# EAGLE design FanRegulator (EAGLE 6.5.0)
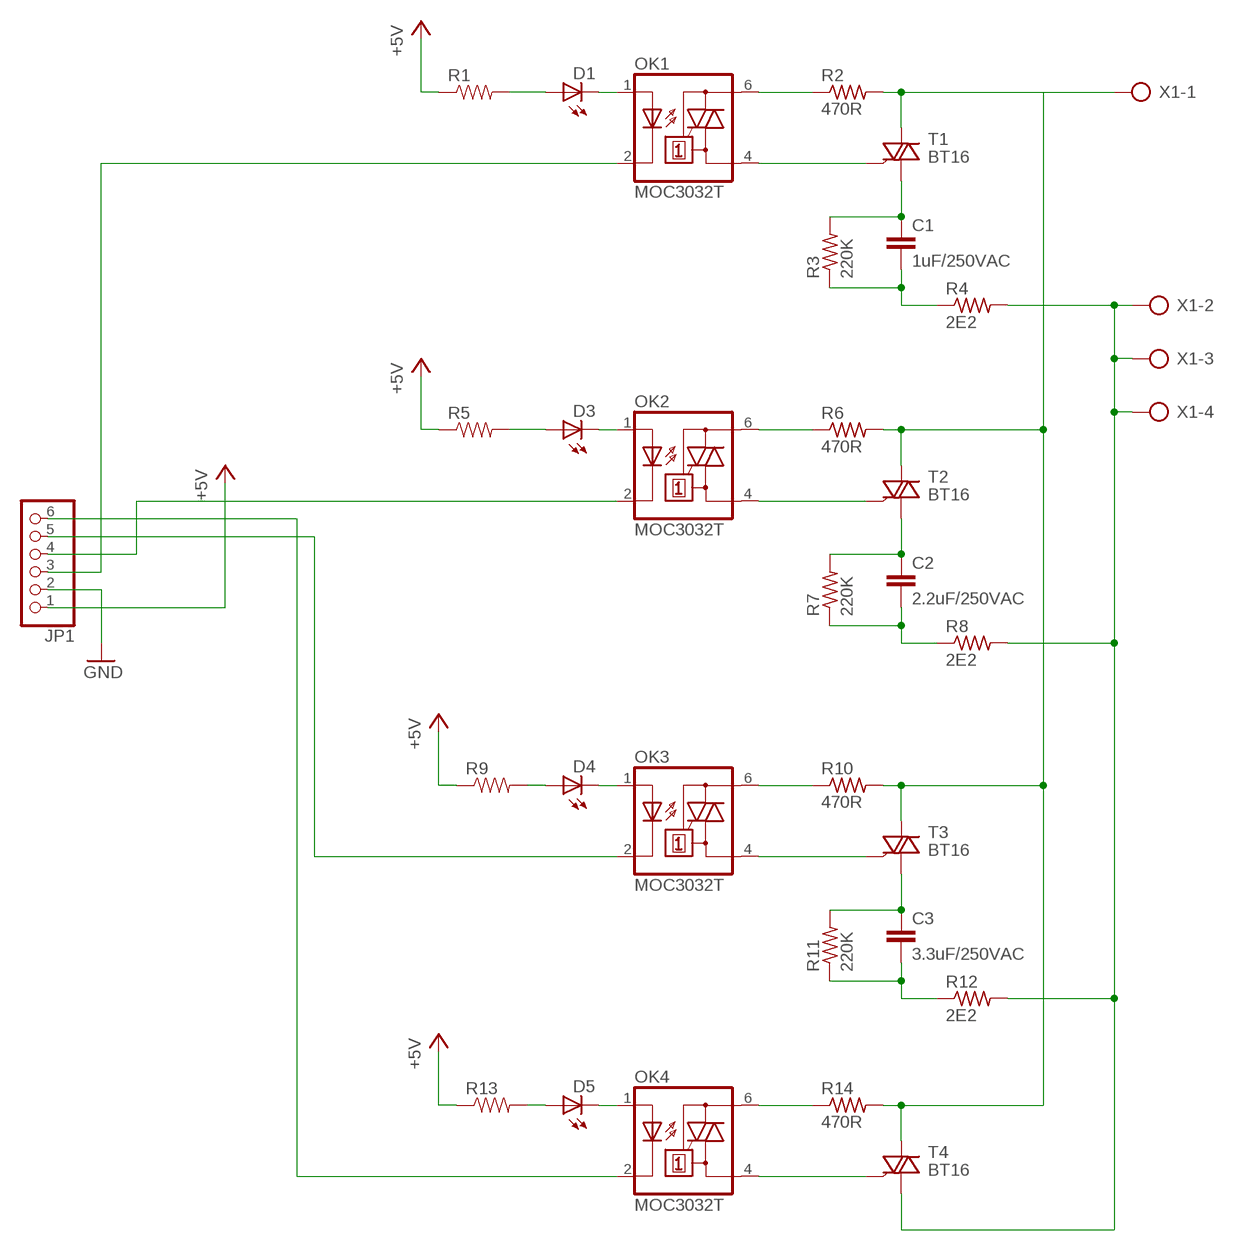
[diagram p0: schematic, sheet 1]

## Parts
C1  1uF/250VAC  C27/9  [C27.5B9]
C2  2.2uF/250VAC  C27/9  [C27.5B9]
C3  3.3uF/250VAC  C27/9  [C27.5B9]
D1  LED3MM  [LED3MM]
D3  LED3MM  [LED3MM]
D4  LED3MM  [LED3MM]
D5  LED3MM  [LED3MM]
JP1  PINHD-1X6  [1X06]
OK1  MOC3032T  [DIL06B]
OK2  MOC3032T  [DIL06B]
OK3  MOC3032T  [DIL06B]
OK4  MOC3032T  [DIL06B]
R1  RESISTOR1206  [1206]
R2  470R  6MM.1  [R0207/1V]
R3  220K  6MM.1  [R0207/1V]
R4  2E2  6MM.1  [R0207/1V]
R5  RESISTOR1206  [1206]
R6  470R  6MM.1  [R0207/1V]
R7  220K  6MM.1  [R0207/1V]
R8  2E2  6MM.1  [R0207/1V]
R9  RESISTOR1206  [1206]
R10  470R  6MM.1  [R0207/1V]
R11  220K  6MM.1  [R0207/1V]
R12  2E2  6MM.1  [R0207/1V]
R13  RESISTOR1206  [1206]
R14  470R  6MM.1  [R0207/1V]
T1  BT16  BT138-V  [TO220BV]
T2  BT16  BT138-V  [TO220BV]
T3  BT16  BT138-V  [TO220BV]
T4  BT16  BT138-V  [TO220BV]
X1  AK300/4  [AK300/4]

## Nets
+5V: JP1.1 R1.1 R5.1 R9.1 R13.1
GND: JP1.2
N$1: OK1.6(A2) R2.1
N$2: OK1.4(A1) T1.G
N$3: D1.A R1.2
N$4: C1.1 R3.2 T1.T1(A1)
N$5: C1.2 R3.1 R4.1
N$6: D1.K(C) OK1.1(A)
N$7: D3.A R5.2
N$8: JP1.3 OK1.2(C)
N$9: OK2.6(A2) R6.1
N$10: OK2.4(A1) T2.G
N$11: R2.2 R6.2 R10.2 R14.2 T1.T2(A2) T2.T2(A2) T3.T2(A2) T4.T2(A2) X1.1
N$12: C2.1 R7.2 T2.T1(A1)
N$13: C2.2 R7.1 R8.1
N$14: D3.K(C) OK2.1(A)
N$15: D4.A R9.2
N$16: JP1.4 OK2.2(C)
N$17: OK3.6(A2) R10.1
N$18: OK3.4(A1) T3.G
N$19: D4.K(C) OK3.1(A)
N$20: C3.1 R11.2 T3.T1(A1)
N$21: C3.2 R11.1 R12.1
N$22: D5.A R13.2
N$23: D5.K(C) OK4.1(A)
N$24: JP1.5 OK3.2(C)
N$25: OK4.6(A2) R14.1
N$26: OK4.4(A1) T4.G
N$32: JP1.6 OK4.2(C)
N$33: R4.2 R8.2 R12.2 T4.T1(A1) X1.2 X1.3 X1.4

## Library data of the parts
C1-C3 = capacitor-wima:C: CAPACITOR naming: grid - package width
D1 D3-D5 = led:LED: LED OSRAM: - CHIPLED LG R971, LG N971, LY N971, LG Q971, LY Q971, LO R971, LY R971 LH N974, LH R974 LS Q976, LO Q976, LY Q976 LO Q996 - Hyper CHIPLED LW Q18S LB Q993, LB Q99A, LB R99A - SideLED LS A670, LO A670, LY A670, LG A670, LP A670 LB A673, LV A673, LT A673, LW A673 LH A674 LY A675 LS A676, LA A676, LO A676, LY A676, LW A676 LS A679, LY A679, LG A679 - Hyper Micro SIDELED® LS Y876, LA Y876, LO Y876, LY Y876 LT Y87S - SmartLED LW L88C, LW L88S LB L89C, LB L89S, LG L890 LS L89K, LO L89K, LY L89K LS L896, LA L896, LO L896, LY L896 - TOPLED LS T670, LO T670, LY T670, LG T670, LP T670 LSG T670, LSP T670, LSY T670, LOP T670, LYG T670 LG T671, LOG T671, LSG T671 LB T673, LV T673, LT T673, LW T673 LH T674 LS T676, LA T676, LO T676, LY T676, LB T676, LH T676, LSB T676, LW T676 LB T67C, LV T67C, LT T67C, LS T67K, LO T67K, LY T67K, LW E67C LS E67B, LA E67B, LO E67B, LY E67B, LB E67C, LV E67C, LT E67C LW T67C LS T679, LY T679, LG T679 LS T770, LO T770, LY T770, LG T770, LP T770 LB T773, LV T773, LT T773, LW T773 LH T774 LS E675, LA E675, LY E675, LS T675 LS T776, LA T776, LO T776, LY T776, LB T776 LHGB T686 LT T68C, LB T68C - Hyper Mini TOPLED® LB M676 - Mini TOPLED Santana® LG M470 LS M47K, LO M47K, LY M47K Source: http://www.osram.convergy.de LUXEON: - LUMILED® LXK2-PW12-R00, LXK2-PW12-S00, LXK2-PW14-U00, LXK2-PW14-V00 LXK2-PM12-R00, LXK2-PM12-S00, LXK2-PM14-U00 LXK2-PE12-Q00, LXK2-PE12-R00, LXK2-PE12-S00, LXK2-PE14-T00, LXK2-PE14-U00 LXK2-PB12-K00, LXK2-PB12-L00, LXK2-PB12-M00, LXK2-PB14-N00, LXK2-PB14-P00, LXK2-PB14-Q00 LXK2-PR12-L00, LXK2-PR12-M00, LXK2-PR14-Q00, LXK2-PR14-R00 LXK2-PD12-Q00, LXK2-PD12-R00, LXK2-PD12-S00 LXK2-PH12-R00, LXK2-PH12-S00 LXK2-PL12-P00, LXK2-PL12-Q00, LXK2-PL12-R00 Source: www.luxeon.com KINGBRIGHT: KA-3528ASYC Source: www.kingbright.com
JP1 = pinhead:PINHD-1X6: PIN HEADER
OK1-OK4 = optocoupler:MOC30*: 6-Pin DIP Zero-Cross Optoisolators Triac Driver Output (250/400 Volt Peak) Source: Data sheet <http://www.fairchildsemi.com/ds/MO/MOC3031M.pdf> The old path of data sheet not more available 2013-05-06.; OC_FARNELL: unknown; OC_NEWARK: unknown
R1 R5 R9 R13 = SparkFun-Passives:RESISTOR: Resistor Basic schematic elements and footprints for 0603, 1206, and PTH resistors.
R2-R4 R6-R8 R10-R12 R14 = gm-resistors:6MM: 6mm Resistors Leads spaced 1-6 holes apart for 0.1" perfboard. Suitable for 1/4 watt resistors.
T1-T4 = triac:BT138: TRIAC Source: http://www.semiconductors.philips.com BT138_SERIES_2.pdf
X1 = con-ptr500:AK300/4: CONNECTOR; OC_FARNELL: unknown; OC_NEWARK: unknown

## Board
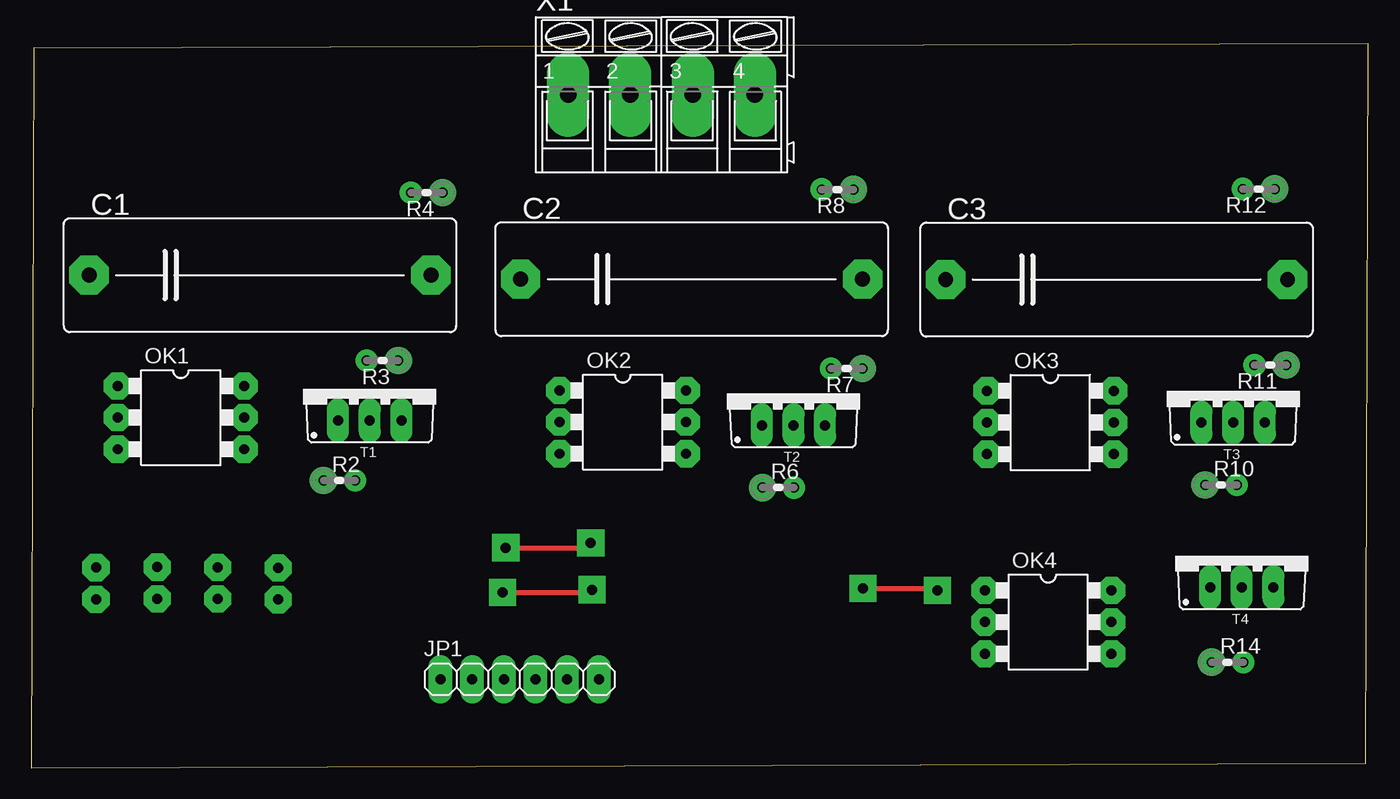
[diagram p1: board, top side]
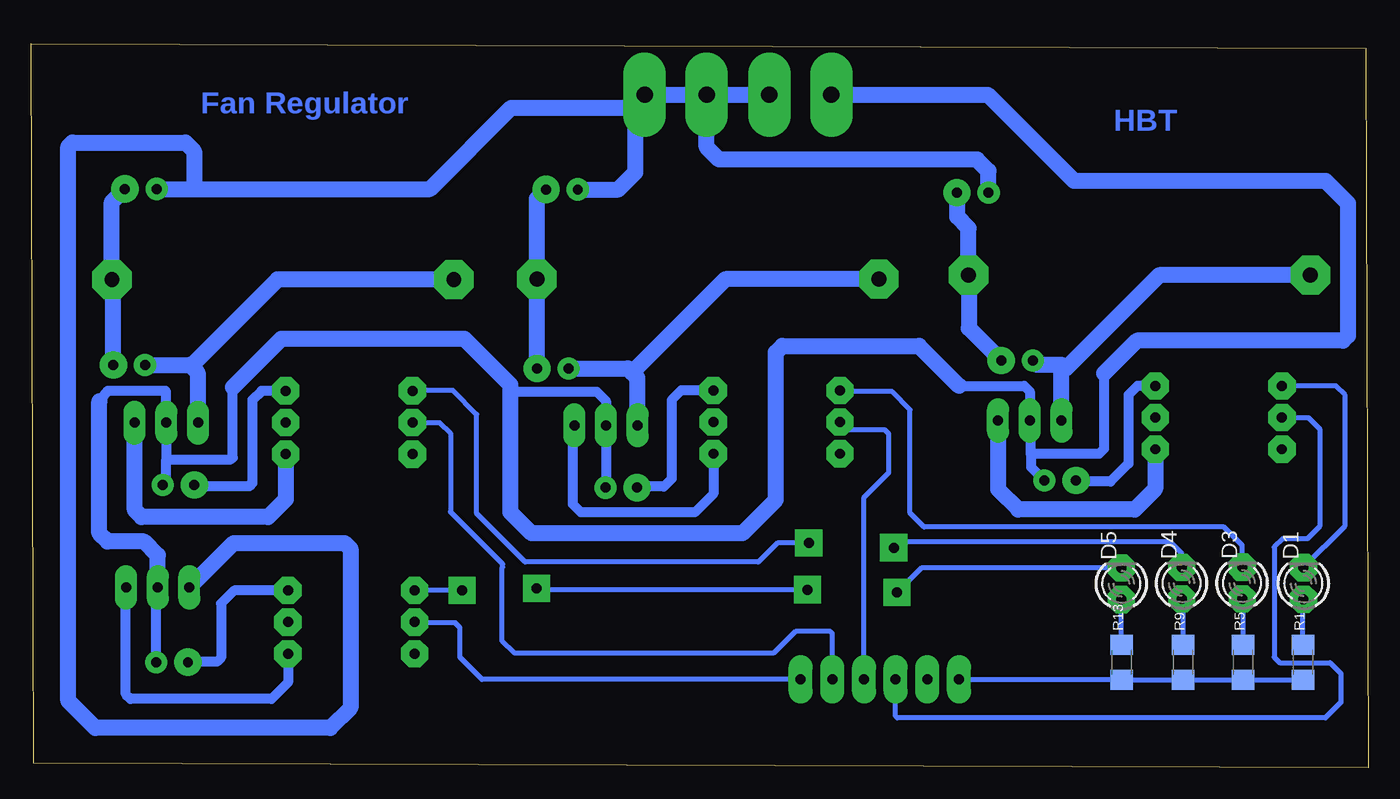
[diagram p2: board, bottom side, seen from below]

Size 107.28 x 58.11 mm. Coordinates in mm from the lower left corner, seen from the top.
Outline: 0,0 107.08,0.36 107.28,58.11 0.2,57.75 0,0
Copper layers (1*16): Top 0.035mm / dielectric 1.5mm / Bottom 0.035mm
Design rules "default": minimum track width 10mil, minimum drill 24mil, track to track 8mil, track to pad 8mil, pad to pad 8mil, via to via 8mil, smd to smd 8mil, copper to edge 40mil, drill to drill 8mil, minimum pad ring 10mil, minimum via ring 8mil, stop-mask expansion 4mil, vias tented up to drill 0mil, thermal gap 10mil

### Footprints (pad centres in the part's own frame; a part is rotated, then mirrored left to right if it is on the bottom)
C27.5B9 = drill 1.194 pad 3.15 octagon: 1 -13.716,0; 2 13.716,0
LED3MM = drill 0.8 pad 2.184 octagon: A -1.27,0; K 1.27,0
1X06 = drill 0.8 pad 1.93 long: 1 -6.35,0; 2 -3.81,0; 3 -1.27,0; 4 1.27,0; 5 3.81,0; 6 6.35,0
DIL06B = drill 0.8 pad 2.184 octagon: 1 -2.54,-5.08; 2 0,-5.08; 3 2.54,-5.08; 4 2.54,5.08; 5 0,5.08; 6 -2.54,5.08
1206 = smd 1.6 x 1.8: 1 -1.4,0; 2 1.4,0
R0207/1V = drill 0.8 pad 2.184: 1 -1.27,0 | drill 0.8 pad 1.778: 2 1.27,0
TO220BV = drill 0.8 pad 1.778 long: G 2.54,-2.54; T1 -2.54,-2.54; T2 0,-2.54
AK300/4 = drill 1.321 pad 3.4 long: 1 -7.493,0; 2 -2.515,0; 3 2.515,0; 4 7.493,0

### Placement (x,y rotation side)
C1  18.36,39.54 0 top
C2  52.99,39.21 0 top
C3  87.09,39.18 0 top
D1  5.2,14.8 90 bottom
D3  10.12,14.84 90 bottom
D4  14.97,14.82 90 bottom
D5  19.81,14.77 90 bottom
JP1  39.2,7.1 0 top
OK1  12.01,28.11 270 top
OK2  47.47,27.74 270 top
OK3  81.78,27.71 270 top
OK4  81.6,11.69 270 top
R1  5.24,8.47 90 bottom
R2  24.72,23.05 0 top
R3  28.19,32.68 180 top
R4  31.74,46.16 180 top
R5  10.04,8.48 90 bottom
R6  59.94,22.48 0 top
R7  65.43,32.04 180 top
R8  64.7,46.41 180 top
R9  14.86,8.47 90 bottom
R10  95.46,22.7 0 top
R11  99.42,32.33 180 top
R12  98.49,46.45 180 top
R13  19.8,8.47 90 bottom
R14  95.98,8.48 0 top
T1  27.17,30.41 0 top
T2  61.16,30.03 0 top
T3  96.44,30.23 0 top
T4  97.13,17.02 0 top
X1  50.57,54.02 0 top

### Tracks (layer width: path | path; a pad name or v marks a point on that pad's centre or on a via)
+5V
  Bottom 0.406: JP1.1 19.83,7.1 R13.1 R9.1 10.05,7.07 R5.1 R1.1
  Bottom 0.813: 19.8,7.1 R13.1
N$1
  Bottom 0.813: 23.3,23.19 R2.1 23.37,22.98 20.68,22.98 19.24,24.42 19.24,29.92 18.52,30.65 OK1.6
N$2
  Bottom 1.27: OK1.4 17.09,22.38 18.75,20.73 28.08,20.73 29.71,22.36 T1.G
N$3
  Bottom 0.406: R1.2 5.24,13.49 D1.A
N$4
  Bottom 0.813: 24.64,32.35 24.3,32.01 24.63,31.69 | R3.2 26.59,32.35
  Bottom 1.27: C1.1 16.78,39.54 24.3,32.01 | 26.59,32.35 24.64,32.35 | T1.T1 24.63,31.69
N$5
  Bottom 0.813: 32.06,39.52 C1.2 | 32.99,46.14 R4.1
  Bottom 1.27: C1.2 32.08,43.31 32.99,44.22 32.99,46.14 | 32.06,39.52 32.06,35.28 R3.1
N$6
  Bottom 0.406: D1.K 1.85,19.42 1.85,29.9 2.6,30.65 OK1.1
  Bottom 0.813: 6.93,30.66 OK1.1
N$7
  Bottom 0.406: R5.2 10.04,13.49 D3.A
N$8
  Bottom 0.406: OK1.2 4.8,28.11 3.9,27.2 3.9,19.38 4.9,18.39 6.88,18.39 7.56,17.71 7.56,8.88 7.12,8.44 3.07,8.44 2.19,7.57 2.19,5.25 3.44,4.01 37.78,4.01 37.93,4.15 JP1.3
N$9
  Bottom 0.813: R6.1 58.59,22.56 56.53,22.56 55.9,23.19 55.9,29.51 55.13,30.28 OK2.6
N$10
  Bottom 0.813: OK2.4 52.55,21.99 54.03,20.51 63.18,20.51 63.82,21.15 63.82,27.37 T2.G
N$11
  Bottom 0.813: R6.2 61.16,22.53 T2.T2 61.16,29.44 61.9,30.18 68.28,30.18 68.85,29.61 | 96.44,24.75 T3.T2 96.51,27.76 96.5,30.27 101.11,30.27 101.81,29.4 | R10.2 96.44,22.98 96.44,24.75 | R14.2 97.25,14.36 T4.T2 | 96.44,24.75 91.25,24.75 91.11,24.89 91.11,30.53 | 21.2,31.64 21.2,25.59 21.61,25.19 27.05,25.19 | 27.05,25.19 27.09,25.22 27.09,27.79 T1.T2 27.17,30.22 27.6,30.65 32.84,30.65 | R2.2 27.05,24.12 27.05,25.19
  Bottom 1.27: T4.T2 97.13,17.06 98.23,18.16 101.15,18.16 101.81,18.83 101.81,29.4 | 91.11,30.53 87.2,34.45 72.54,34.45 68.85,30.75 68.85,29.61 68.85,20.53 67.13,18.81 50.23,18.81 47.54,21.5 47.54,33.33 47.02,33.85 36.04,33.85 32.84,30.65 | X1.1 30.53,54.02 23.62,47.11 3.44,47.11 1.64,45.32 1.64,34.69 2.04,34.29 18.56,34.29 21.2,31.64
N$12
  Bottom 0.813: 58.66,27.53 T2.T1
  Bottom 1.27: R7.2 59.41,32.04 59.08,31.71 | 59.08,31.71 58.66,31.29 58.66,27.53 | C2.1 51.58,39.21 59.08,31.71
N$13
  Bottom 0.813: 66.7,39.2 C2.2
  Bottom 1.27: R7.1 66.7,39.2 | C2.2 66.7,45.68 R8.1
N$14
  Bottom 0.406: D3.K 10.12,17.86 11.59,19.33 35.65,19.33 36.76,20.44 36.76,28.74 38.2,30.18 42.28,30.18 OK2.1
N$15
  Bottom 0.406: R9.2 14.85,13.43 D4.A
N$16
  Bottom 0.406: JP1.4 40.47,21.71 38.47,23.7 38.47,26.79 38.8,27.11 41.76,27.11 OK2.2
N$17
  Bottom 0.813: 94.17,22.71 R10.1 94.08,22.6 89.78,22.6 89.53,22.84 89.53,29.52 88.81,30.25 OK3.6
N$18
  Bottom 0.813: T3.G
  Bottom 1.27: OK3.4 86.86,21.54 88.28,20.11 98.41,20.11 98.97,20.67 T3.G
N$19  (via drill 0.8 pad 2.18)
  Top 0.406: v38.08,17.66 44.51,17.66 v44.89,18.04
  Bottom 0.406: D4.K 14.97,17.21 15.89,18.12 37.62,18.12 v38.08,17.66 | OK3.1 76.66,30.29 73.45,30.29 71.53,28.37 71.53,20.39 67.64,16.5 48.93,16.5 47.39,18.04 v44.89,18.04
N$20
  Bottom 0.813: 94.55,32.33 94.45,32.24 | 93.93,27.72 T3.T1
  Bottom 1.27: R11.2 94.55,32.33 | 93.93,27.72 93.93,31.72 94.45,32.24 87.51,39.18 C3.1
N$21
  Bottom 0.813: 100.69,39.07 C3.2
  Bottom 1.27: R11.1 100.69,39.07 | C3.2 100.8,45.41 R12.1
N$22
  Bottom 0.406: R13.2 D5.A
N$23  (via drill 0.8 pad 2.18)
  Top 0.406: v37.81,14.07 44.78,14.07 v45,14.29 | v66.74,14.4 72.55,14.4 v72.72,14.24
  Bottom 0.406: D5.K 35.84,16.04 v37.81,14.07 | v45,14.29 66.63,14.29 v66.74,14.4 | v72.72,14.24 OK4.1
N$24
  Bottom 0.406: OK3.2 74.51,27.71 73.65,26.86 73.65,20.54 69.46,16.35 69.46,16.11 69.49,16.09 69.49,10.16 68.55,9.23 47.68,9.23 45.92,10.98 43.21,10.98 43.03,10.8 43.03,7.13 JP1.5
N$25
  Bottom 0.813: OK4.6 91,14.23 92.04,13.18 92.04,8.83 92.37,8.51 94.67,8.51 R14.1
N$26
  Bottom 0.813: OK4.4 86.68,6.85 88,5.53 99.3,5.53 99.68,5.91 99.68,14.46 T4.G
N$32
  Bottom 0.406: JP1.6 71.12,7.1 72.88,8.87 72.88,11.25 73.27,11.63 76.46,11.63 OK4.2
N$33
  Bottom 0.813: 59.11,52.97 59.2,52.97 58.8,52.58 | X1.3
  Bottom 1.27: R12.2 94.2,46.45 | 94.2,46.45 75.28,46.45 68.76,52.97 59.2,52.97 | 59.11,52.97 X1.4 X1.3 X1.2 | R8.2 60.18,46.41 58.8,47.79 58.8,52.58 | R4.2 30.47,47.9 31.39,48.82 52.08,48.82 53.08,49.82 X1.3 | T4.T1 91.02,18.05 82.14,18.05 81.67,17.57 81.67,4.83 83.29,3.2 102.13,3.2 104.3,5.37 104.3,49.85 103.98,50.17 94.9,50.17 94.2,49.48 94.2,46.45

### Text on the board
Bottom: Fan Regulator | HBT